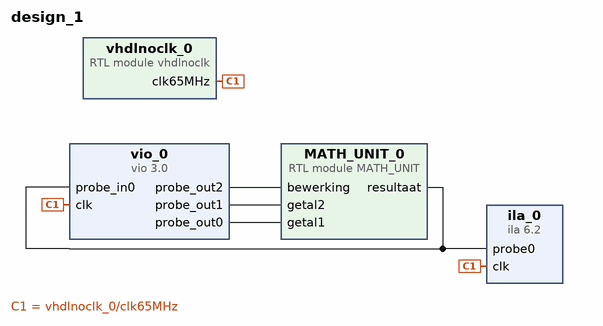
[diagram p0: block diagram of the top level]
# Vivado block design design_1, xc7z007sclg225-1, Vivado 2018.2
create_bd_design design_1

create_bd_cell -type module -reference MATH_UNIT MATH_UNIT_0
create_bd_cell -type ip -vlnv xilinx.com:ip:ila:6.2 ila_0
set_property -dict [list \
  CONFIG.C_PROBE0_WIDTH 32 \
  CONFIG.C_NUM_OF_PROBES 1 \
  CONFIG.ALL_PROBE_SAME_MU true \
  CONFIG.C_ENABLE_ILA_AXI_MON false \
  CONFIG.C_MONITOR_TYPE Native \
] [get_bd_cells ila_0]
create_bd_cell -type module -reference vhdlnoclk vhdlnoclk_0
create_bd_cell -type ip -vlnv xilinx.com:ip:vio:3.0 vio_0
set_property -dict [list \
  CONFIG.C_PROBE_OUT2_WIDTH 3 \
  CONFIG.C_PROBE_OUT1_WIDTH 32 \
  CONFIG.C_PROBE_OUT0_WIDTH 32 \
  CONFIG.C_NUM_PROBE_OUT 3 \
  CONFIG.C_EN_PROBE_IN_ACTIVITY 0 \
] [get_bd_cells vio_0]

# ---- connections ----

connect_bd_net [get_bd_pins MATH_UNIT_0/resultaat] [get_bd_pins ila_0/probe0] [get_bd_pins vio_0/probe_in0]
connect_bd_net [get_bd_pins vhdlnoclk_0/clk65MHz] [get_bd_pins ila_0/clk] [get_bd_pins vio_0/clk]
connect_bd_net [get_bd_pins vio_0/probe_out2] [get_bd_pins MATH_UNIT_0/bewerking]
connect_bd_net [get_bd_pins vio_0/probe_out1] [get_bd_pins MATH_UNIT_0/getal2]
connect_bd_net [get_bd_pins vio_0/probe_out0] [get_bd_pins MATH_UNIT_0/getal1]

validate_bd_design
save_bd_design
